# EAGLE design RespiroProject v0.4 (EAGLE 8.2.0)
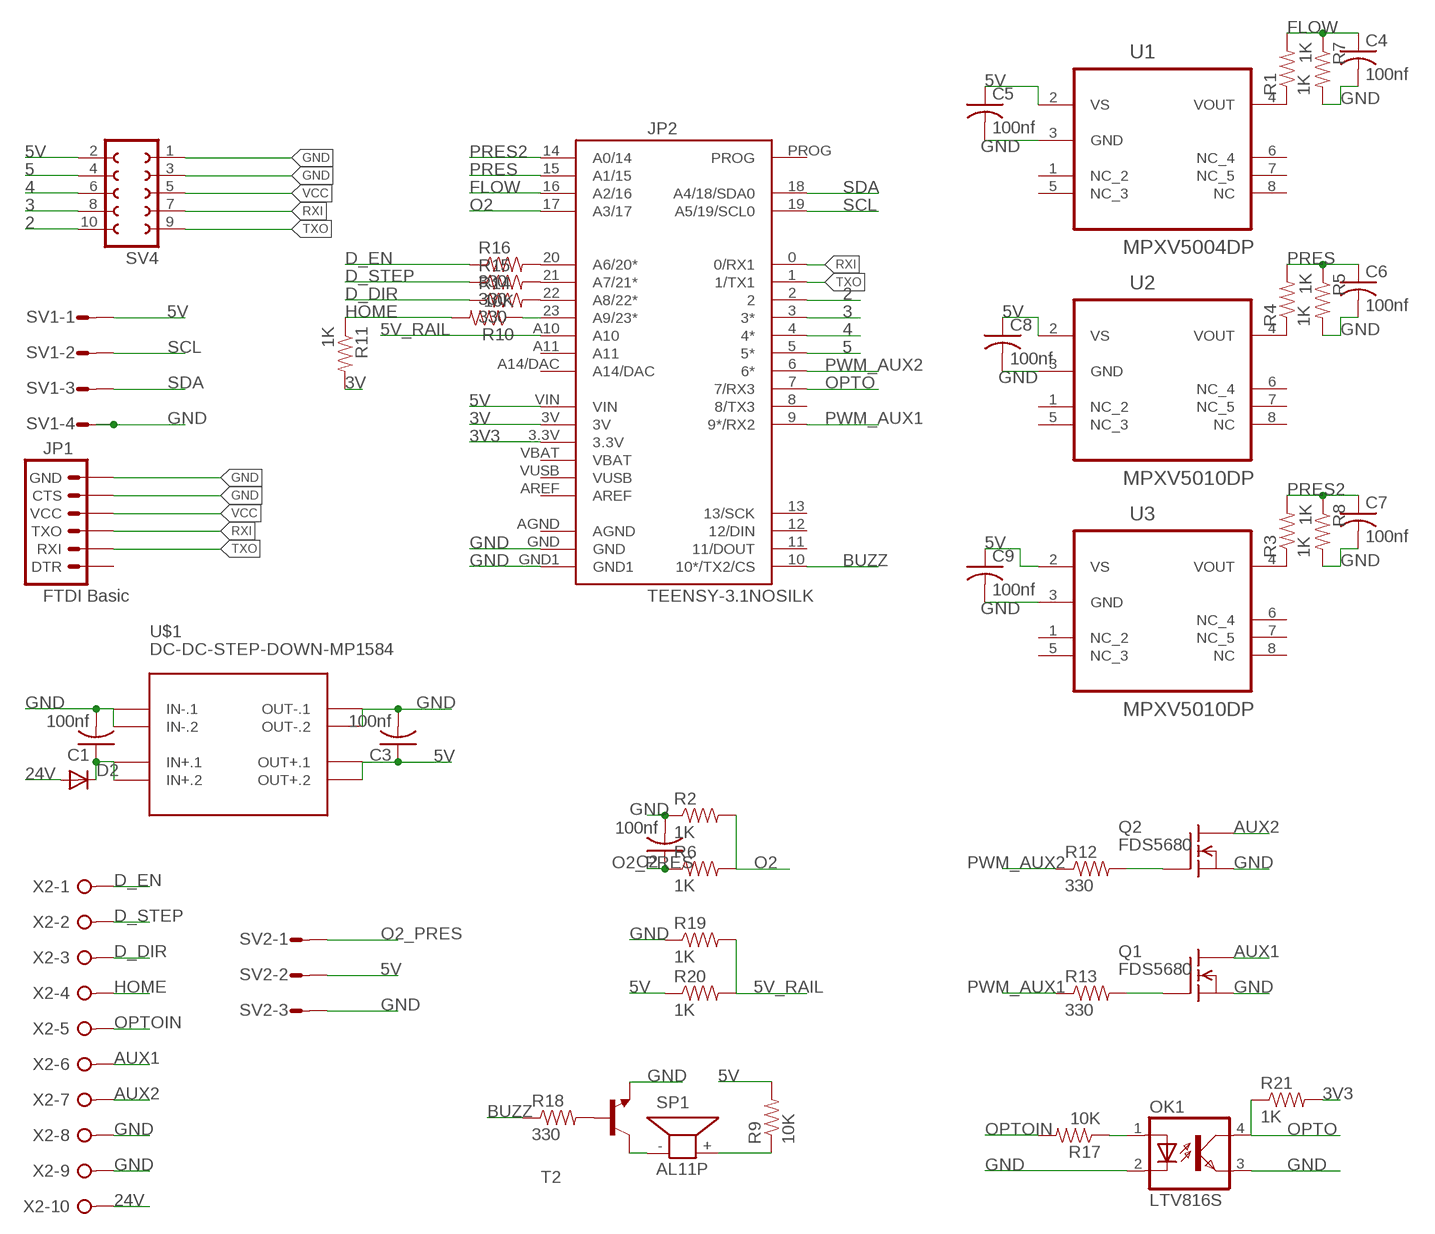
[diagram p0: schematic, sheet 1]

## Parts
C1  100nf  C-USC0805  [C0805]
C2  100nf  C-USC0805  [C0805]
C3  100nf  C-USC0805  [C0805]
C4  100nf  C-USC0805  [C0805]
C5  100nf  C-USC0805  [C0805]
C6  100nf  C-USC0805  [C0805]
C7  100nf  C-USC0805  [C0805]
C8  100nf  C-USC0805  [C0805]
C9  100nf  C-USC0805  [C0805]
D2  DIODE-MINIMELF  [MINIMELF]
JP1  FTDI Basic  ARDUINO_SERIAL_PROGRAMPTH  [1X06]
JP2  TEENSY-3.1NOSILK  [TEENSY-3.1_NOSILK]
OK1  LTV816S  [DIL4-SMD]
Q1  FDS5680  [SO-8]
Q2  FDS5680  [SO-8]
R1  1K  RESISTOR0805-RES  [0805]
R2  1K  RESISTOR0805-RES  [0805]
R3  1K  RESISTOR0805-RES  [0805]
R4  1K  RESISTOR0805-RES  [0805]
R5  1K  RESISTOR0805-RES  [0805]
R6  1K  RESISTOR0805-RES  [0805]
R7  1K  RESISTOR0805-RES  [0805]
R8  1K  RESISTOR0805-RES  [0805]
R9  10K  RESISTOR0805-RES  [0805]
R10  10K  RESISTOR0805-RES  [0805]
R11  1K  RESISTOR0805-RES  [0805]
R12  330  RESISTOR0805-RES  [0805]
R13  330  RESISTOR0805-RES  [0805]
R14  330  RESISTOR0805-RES  [0805]
R15  330  RESISTOR0805-RES  [0805]
R16  330  RESISTOR0805-RES  [0805]
R17  10K  RESISTOR0805-RES  [0805]
R18  330  RESISTOR0805-RES  [0805]
R19  1K  RESISTOR0805-RES  [0805]
R20  1K  RESISTOR0805-RES  [0805]
R21  1K  RESISTOR0805-RES  [0805]
SP1  AL11P  [AL11P]
SV1  S04P  [S04P]
SV2  S03P  [S03P]
SV4  FE05-2  [FE05-2]
T2  BC817-16-NPN-SOT23-BEC  [SOT23-BEC]
U1  MPXV5004DP  [FREESCALE_CASE_1351-01]
U2  MPXV5010DP  MPXV5004DP  [FREESCALE_CASE_1351-01]
U3  MPXV5010DP  MPXV5004DP  [FREESCALE_CASE_1351-01]
U$1  DC-DC-STEP-DOWN-MP1584  [DC-DC-STEP-DOWN-MP1584]
X2  W237-10P  [W237-10P]

## Nets
2: JP2.2 SV4.10
3: JP2.3(3*) SV4.8
3V: JP2.3V R11.2
3V3: JP2.3.3V R21.2
4: JP2.4(4*) SV4.6
5: JP2.5(5*) SV4.4
5V: C3.1 C5.1 C8.1 C9.1 JP2.VIN R9.2 R20.1 SV1.1 SV2.2 SV4.2 U1.2(VS) U2.2(VS) U3.2(VS) U$1.OUT+.1 U$1.OUT+.2
5V_RAIL: JP2.A10 R19.2 R20.2
24V [power]: D2.A X2.10
AUX1 [power]: Q1.5(D) Q1.6(D) Q1.7(D) Q1.8(D) X2.6
AUX2: Q2.5(D) Q2.6(D) Q2.7(D) Q2.8(D) X2.7
BUZZ: JP2.10(10*/TX2/CS) R18.1
D_DIR: R14.1 X2.3
D_EN: R16.1 X2.1
D_STEP: R15.1 X2.2
FLOW: C4.1 JP2.16(A2/16) R1.2 R7.1
GND [power]: C1.2 C2.2 C3.2 C4.2 C5.2 C6.2 C7.2 C8.2 C9.2 JP1.5(CTS) JP1.6(GND) JP2.GND JP2.GND1 OK1.2(C) OK1.3(EMIT) Q1.1(S) Q1.2(S) Q1.3(S) Q2.1(S) Q2.2(S) Q2.3(S) R2.1 R5.2 R7.2 R8.2 R19.1 SV1.4 SV2.3 SV4.1 SV4.3 T2.E U1.3(GND) U2.3(GND) U3.3(GND) U$1.IN-.1 U$1.IN-.2 U$1.OUT-.1 U$1.OUT-.2 X2.8 X2.9
HOME: R10.2 R11.1 X2.4
N$1: C1.1 D2.C U$1.IN+.1 U$1.IN+.2
N$2: R1.1 U1.4(VOUT)
N$3: R3.1 U3.4(VOUT)
N$4: R4.1 U2.4(VOUT)
N$5: SP1.- T2.C
N$6: R9.1 SP1.+
N$8: JP2.23(A9/23*) R10.1
N$9: JP2.22(A8/22*) R14.2
N$10: Q2.4(G) R12.2
N$11: Q1.4(G) R13.2
N$12: JP2.21(A7/21*) R15.2
N$13: JP2.20(A6/20*) R16.2
N$14: OK1.1(A) R17.1
N$15: R18.2 T2.B
O2: JP2.17(A3/17) R2.2 R6.2
O2_PRES: C2.1 R6.1 SV2.1
OPTO: JP2.7(7/RX3) OK1.4(COL) R21.1
OPTOIN: R17.2 X2.5
PRES: C6.1 JP2.15(A1/15) R4.2 R5.1
PRES2: C7.1 JP2.14(A0/14) R3.2 R8.1
PWM_AUX1: JP2.9(9*/RX2) R13.1
PWM_AUX2: JP2.6(6*) R12.1
RXI: JP1.3(TXO) JP2.0(0/RX1) SV4.7
SCL: JP2.19(A5/19/SCL0) SV1.2
SDA: JP2.18(A4/18/SDA0) SV1.3
TXO: JP1.2(RXI) JP2.1(1/TX1) SV4.9
VCC: JP1.4(VCC) SV4.5
Unconnected: JP1.1(DTR) JP2.8(8/TX3) JP2.11(11/DOUT) JP2.12(12/DIN) JP2.13(13/SCK) JP2.A11 JP2.A14/DAC JP2.AGND JP2.AREF JP2.PROG JP2.VBAT JP2.VUSB U1.1(NC_2) U1.5(NC_3) U1.6(NC_4) U1.7(NC_5) U1.8(NC) U2.1(NC_2) U2.5(NC_3) U2.6(NC_4) U2.7(NC_5) U2.8(NC) U3.1(NC_2) U3.5(NC_3) U3.6(NC_4) U3.7(NC_5) U3.8(NC)

## Library data of the parts
C1-C9 = rcl:C-US: CAPACITOR, American symbol
D2 = diode:DIODE-: DIODE
JP1 = SparkFun:ARDUINO_SERIAL_PROGRAM
JP2 = Testing:TEENSY-3.1
OK1 = optocoupler:LTV816: OPTO COUPLER Source: LITEON, LTV816.pdf
Q1 Q2 = transistor-fet:FDS5680: 60V N-Channel PowerTrench TM MOSFET FAIRCHILD FDS5680.pdf
R1-R21 = SparkFun:RESISTOR: Resistor Basic schematic elements and footprints for 0603, 1206, and PTH resistors.
SP1 = buzzer:AL11P: SPEAKER Source: Buerklin; OC_FARNELL: unknown; OC_NEWARK: unknown
SV1 = con-amp-mt:S04P: AMP MT CONNECTOR; OC_FARNELL: unknown; OC_NEWARK: unknown
SV2 = con-amp-mt:S03P: AMP MT CONNECTOR; OC_FARNELL: unknown; OC_NEWARK: unknown
SV4 = con-lsta:FE05-2: FEMALE HEADER; OC_FARNELL: unknown; OC_NEWARK: unknown
T2 = transistor-neu-to92:*-NPN-: NPN Transistror
U1-U3 = Freescale-MPxx_MRFxx:MP: Integrated Silicon Pressure Sensor On-Chip Signal Conditioned,Temperature Compensated and Calibrated,CASE 1351-01; MPN: MPXV5004DP; OC_FARNELL: 1457165; OC_NEWARK: 75C3903; PACKAGE: CASE 1351-01; SUPPLIER: FREESCALE SEMICONDUCTOR
U$1 = diy-modules:DC-DC-STEP-DOWN-MP1584: DC/DC Step-Down Regulator based on MP1584 chip MP1584 datasheet available here: http://www.haoyuelectronics.com/Attachment/MP1584/MP1584.pdf Click here to find device on ebay.com <http://www.ebay.com/sch/mp1584+module>
X2 = con-wago-508:W237-10P: WAGO SREW CLAMP; OC_FARNELL: unknown; OC_NEWARK: unknown

## Net classes
1 power: width 0.254 mm, drill 0.711 mm, clearance 0.355 mm to class 0, clearance 0.355 mm
2 gnd: width 0.254 mm, drill 0.711 mm, clearance 0.355 mm to class 0, clearance 0.355 mm to class 1, clearance 0.355 mm

## Board
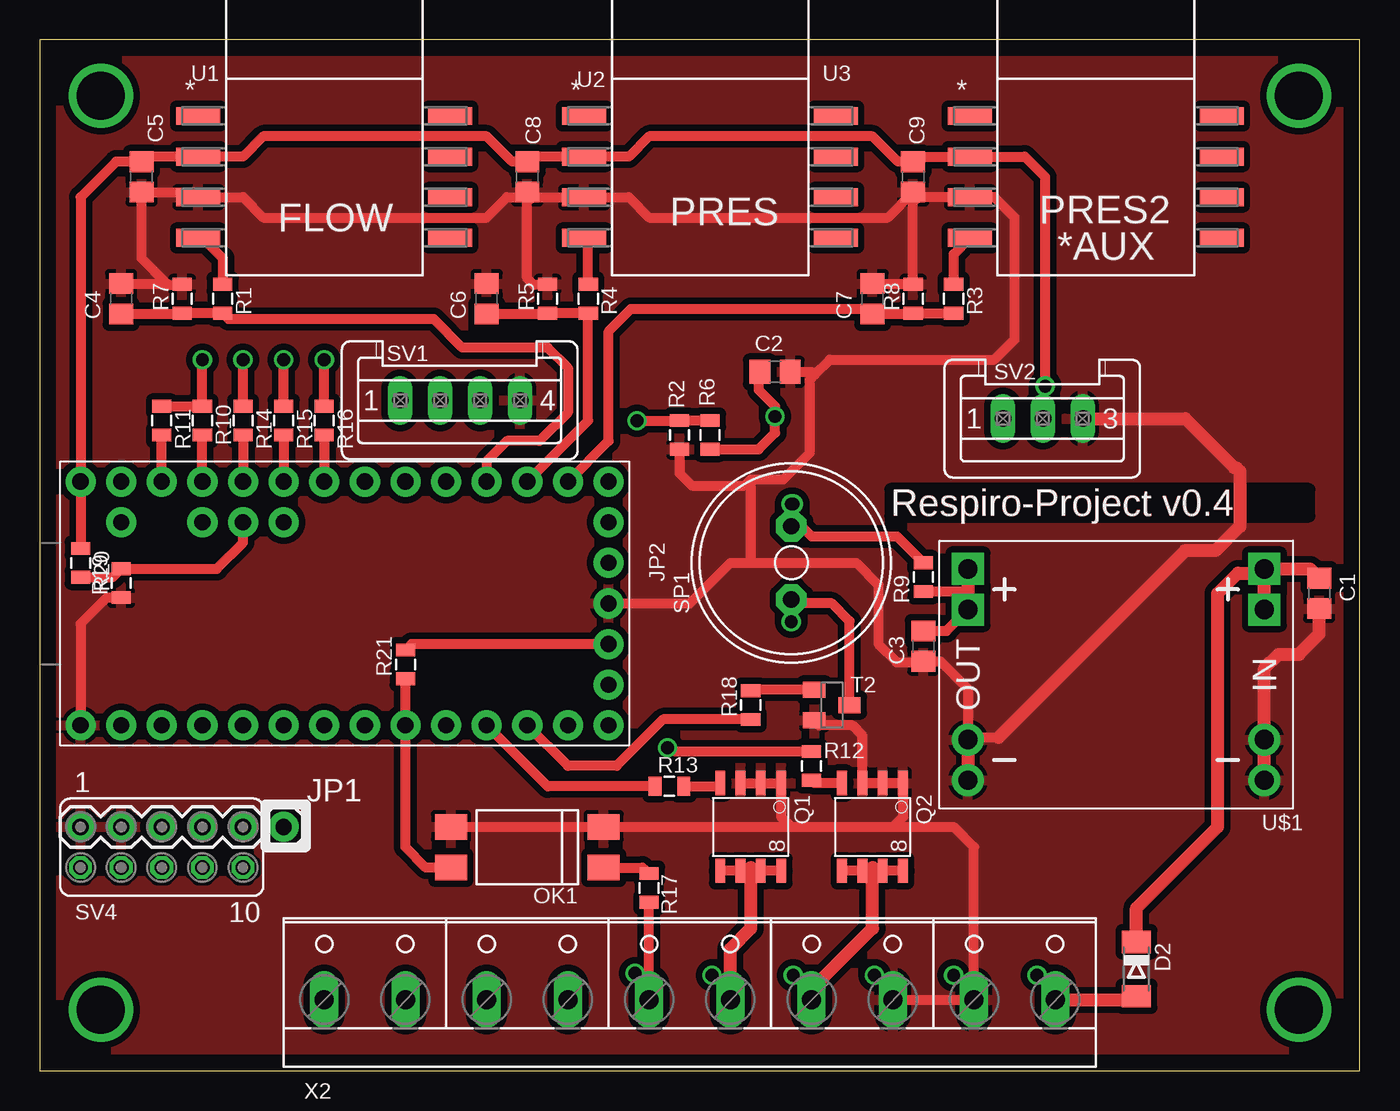
[diagram p1: board, top side]
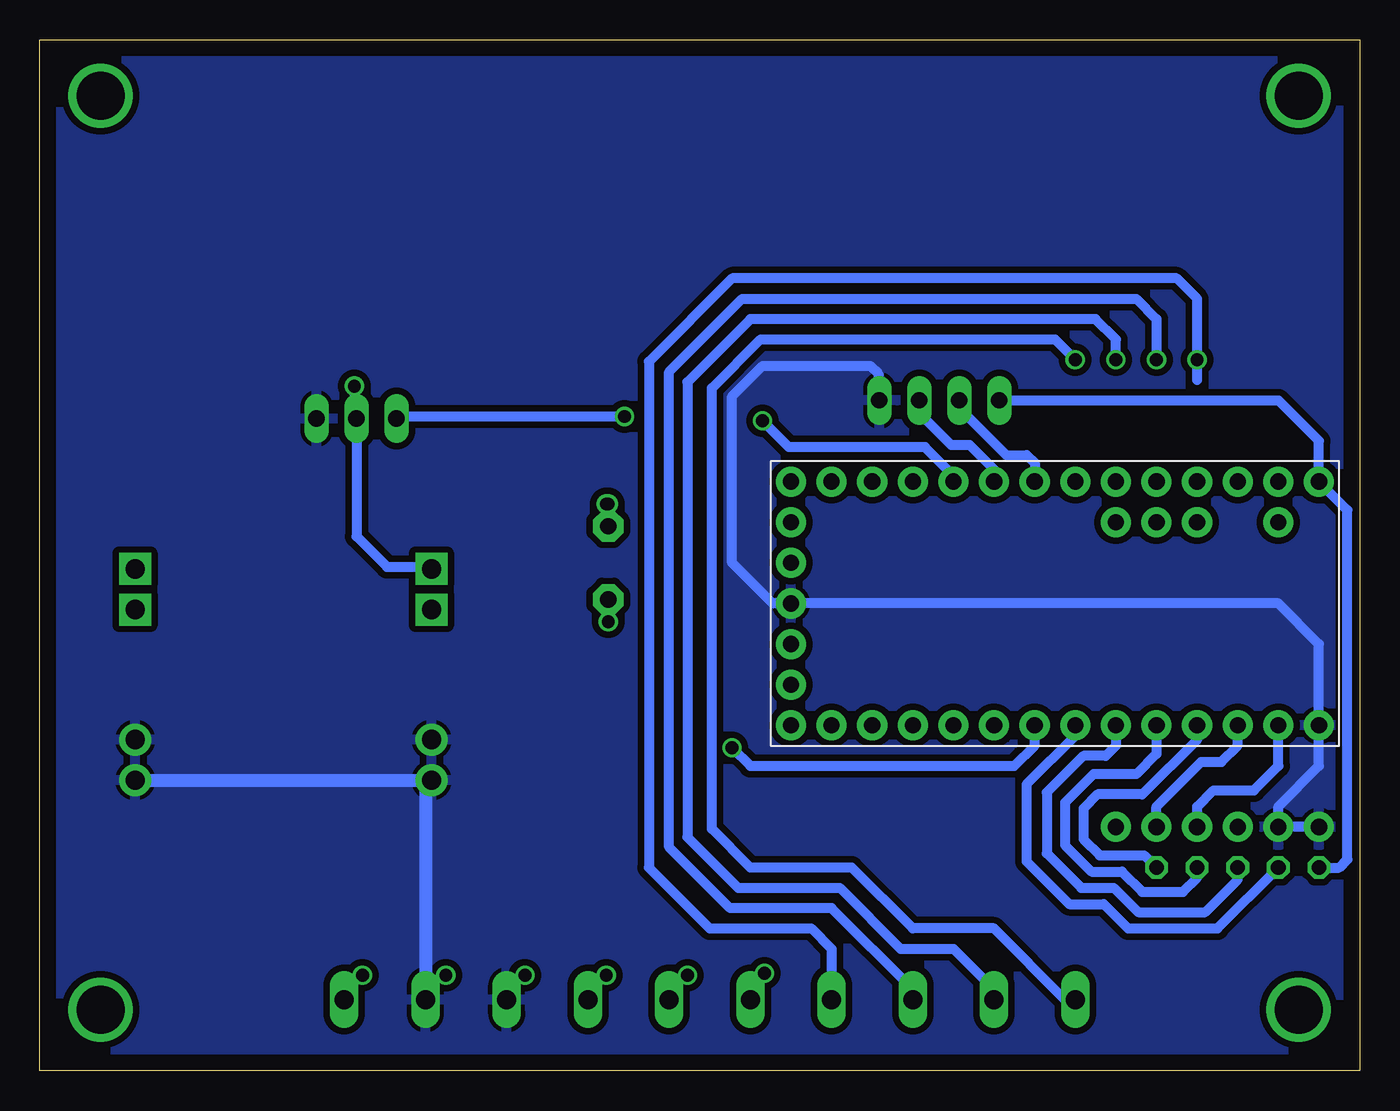
[diagram p2: board, bottom side, seen from below]

Size 82.53 x 64.44 mm. Coordinates in mm from the lower left corner, seen from the top.
Outline: 0,0 82.53,0 82.53,64.44 0,64.44 0,0
Copper layers (1*16): Top 0.035mm / dielectric 1.5mm / Bottom 0.035mm
Design rules "default": minimum track width 6mil, minimum drill 0.35mm, track to track 6mil, track to pad 6mil, pad to pad 6mil, via to via 6mil, smd to smd 6mil, copper to edge 40mil, drill to drill 6mil, minimum pad ring 10mil, minimum via ring 8mil, stop-mask expansion 4mil, vias tented up to drill 0mil, thermal gap 10mil

### Footprints (pad centres in the part's own frame; a part is rotated, then mirrored left to right if it is on the bottom)
C0805 = smd 1.3 x 1.5: 1 -0.95,0; 2 0.95,0
MINIMELF = smd 1.4 x 1.8: A 1.7,0; C -1.7,0
1X06 = drill 1.016 pad 1.88: 1 0,0; 2 2.54,0; 3 5.08,0; 4 7.62,0; 5 10.16,0; 6 12.7,0
TEENSY-3.1_NOSILK = drill 1.016 pad 1.88: 0 16.51,3.81; 1 16.51,6.35; 2 16.51,8.89; 3 16.51,11.43; 3.3V 11.43,34.29; 3V 1.27,6.35; 4 16.51,13.97; 5 16.51,16.51; 6 16.51,19.05; 7 16.51,21.59; 8 16.51,24.13; 9 16.51,26.67; 10 16.51,29.21; 11 16.51,31.75; 12 16.51,34.29; 13 1.27,34.29; 14 1.27,31.75; 15 1.27,29.21; 16 1.27,26.67; 17 1.27,24.13; 18 1.27,21.59; 19 1.27,19.05; 20 1.27,16.51; 21 1.27,13.97; 22 1.27,11.43; 23 1.27,8.89; A10 3.81,11.43; A11 3.81,13.97; A14/DAC 3.81,34.29; AGND 1.27,3.81; AREF 3.81,8.89; GND 8.89,34.29; GND1 16.51,1.27; PROG 6.35,34.29; VBAT 13.97,34.29; VIN 1.27,1.27; VUSB 3.81,3.81
DIL4-SMD = smd 1.6 x 2: 1 -1.27,-4.77; 2 1.27,-4.77; 3 1.27,4.77; 4 -1.27,4.77
SO-8 = smd 1.524 x 0.61: 1 -2.743,1.905; 2 -2.743,0.635; 3 -2.743,-0.635; 4 -2.743,-1.905; 5 2.743,-1.905; 6 2.743,-0.635; 7 2.743,0.635; 8 2.743,1.905
0805 = smd 0.8 x 1.2: 1 -0.9,0; 2 0.9,0
AL11P = drill 1.016 pad 1.905 octagon: + 2.286,0; - -2.286,0
S04P = drill 1.016 long: 1 3.75,0; 2 1.25,0; 3 -1.25,0; 4 -3.75,0
S03P = drill 1.016 long: 1 2.5,0; 2 0,0; 3 -2.5,0
FE05-2 = drill 0.914: 1 -5.08,1.27 | drill 0.914 octagon: 2 -5.08,-1.27; 3 -2.54,1.27; 4 -2.54,-1.27; 5 0,1.27; 6 0,-1.27; 7 2.54,1.27; 8 2.54,-1.27; 9 5.08,1.27; 10 5.08,-1.27
SOT23-BEC = smd 1 x 1.4: B -0.95,-1.1; C 0,1.1; E 0.95,-1.1
FREESCALE_CASE_1351-01 = smd 2.743 x 1.118: 1 -7.874,3.81; 2 -7.874,1.27; 3 -7.874,-1.27; 4 -7.874,-3.81; 5 7.874,-3.81; 6 7.874,-1.27; 7 7.874,1.27; 8 7.874,3.81
DC-DC-STEP-DOWN-MP1584 = drill 1.2 pad 2 square: IN+.1 -9.271,-4.064; IN+.2 -9.271,-6.604; OUT+.1 9.271,-4.064; OUT+.2 9.271,-6.604 | drill 1.2 pad 2: IN-.1 -9.271,6.604; IN-.2 -9.271,4.064; OUT-.1 9.271,6.604; OUT-.2 9.271,4.064
W237-10P = drill 1.194 long: 1 -22.86,-0.635; 2 -17.78,-0.635; 3 -12.7,-0.635; 4 -7.62,-0.635; 5 -2.54,-0.635; 6 2.54,-0.635; 7 7.62,-0.635; 8 12.7,-0.635; 9 17.78,-0.635; 10 22.86,-0.635

### Placement (x,y rotation side)
C1  80.01,29.84 270 top
C2  45.97,43.69 0 top
C3  55.24,26.54 270 top
C4  5.08,48.26 90 top
C5  6.35,55.88 270 top
C6  27.94,48.26 90 top
C7  52.07,48.26 90 top
C8  30.48,55.88 270 top
C9  54.61,55.88 270 top
D2  68.58,6.35 270 top
JP1  15.24,15.24 180 top
JP2  1.27,38.1 270 top
OK1  30.48,13.97 90 top
Q1  44.45,15.24 270 top
Q2  52.07,15.24 270 top
R1  11.43,48.26 270 top
R2  40.01,39.75 90 top
R3  57.15,48.26 270 top
R4  34.29,48.26 270 top
R5  31.75,48.26 90 top
R6  41.91,39.75 90 top
R7  8.89,48.26 90 top
R8  54.61,48.26 90 top
R9  55.24,30.86 270 top
R10  10.16,40.64 90 top
R11  7.62,40.64 270 top
R12  48.26,19.05 270 top
R13  39.37,17.78 0 top
R14  12.7,40.64 270 top
R15  15.24,40.64 270 top
R16  17.78,40.64 270 top
R17  38.1,11.43 270 top
R18  44.45,22.86 90 top
R19  5.08,30.48 90 top
R20  2.54,31.75 270 top
R21  22.86,25.4 90 top
SP1  46.99,31.75 90 top
SV1  26.29,41.91 180 top
SV2  62.74,40.77 180 top
SV4  7.62,13.97 0 top
T2  49.53,22.86 270 top
U1  17.78,55.88 0 top
U2  41.91,55.88 0 top
U3  66.04,55.88 0 top
U$1  67.31,24.77 180 top
X2  40.64,5.08 0 top

### Tracks (layer width: path | path; a pad name or v marks a point on that pad's centre or on a via)
2
  Bottom 0.61: JP2.2 10.16,20.7 13.59,17.27 16.38,17.27 17.27,16.38 17.27,14.48 16.26,13.46 13.46,13.46 SV4.10
3
  Bottom 0.61: JP2.3 12.7,19.81 13.97,18.54 16.64,18.54 18.41,16.76 18.41,14.1 16.76,12.45 14.86,12.45 13.59,11.18 11.05,11.18 10.16,12.06 SV4.8
3V
  Top 0.61: JP2.3V R11.2
3V3
  Top 0.61: JP2.3.3V 23.23,26.67 R21.2
4
  Bottom 0.61: JP2.4 15.24,20.32 15.88,19.68 17.27,19.68 19.56,17.4 19.56,13.59 17.4,11.43 15.37,11.43 13.84,9.91 9.65,9.91 7.62,11.94 SV4.6
5
  Bottom 0.61: JP2.5 17.78,20.95 20.83,17.91 20.83,13.08 18.16,10.41 16,10.41 14.48,8.89 8.89,8.89 SV4.4
5V  (via drill 0.8)
  Top 0.61: R20.1 JP2.VIN 2.54,54.61 4.76,56.83 C5.1 6.67,57.15 U1.2 12.7,57.15 13.97,58.42 27.94,58.42 29.53,56.83 C8.1 30.8,57.15 U2.2 36.83,57.15 38.1,58.42 52.07,58.42 53.66,56.83 C9.1 54.93,57.15 U3.2 61.59,57.15 62.87,55.88 v62.87,42.8 | C3.1 56.7,27.49 U$1.OUT+.1 | R9.2 57.9,29.96 58.04,30.1
  Top 0.813: U$1.OUT+.1 58.04,30.1 U$1.OUT+.2 57.47,30.8
  Bottom 0.61: SV1.1 5.08,41.91 2.54,39.37 JP2.VIN 0.76,35.05 0.76,13.21 1.27,12.7 SV4.2 | U$1.OUT+.2 58.17,31.5 60.83,31.5 62.74,33.4 SV2.2 62.87,40.89 v62.87,42.8
5V_RAIL
  Top 0.61: R20.2 4.55,30.85 R19.2 11.06,31.38 12.7,33.02 JP2.A10
24V
  Top 0.813: X2.10 68.38,4.45 D2.A
AUX1
  Top 0.61: Q1.8 Q1.7 | Q1.7 Q1.6 Q1.5 | Q1.7 44.65,12.5 44.45,12.7
  Top 0.813: X2.6 43.18,7.62 44.45,8.89 44.45,12.7
AUX2
  Top 0.61: Q2.8 Q2.7 52.27,12.5 52.07,12.7 51.64,12.7 Q2.6 Q2.5
  Top 0.813: X2.7 48.26,5.08 52.07,8.89 52.07,12.7
BUZZ
  Top 0.61: R18.1 38.98,21.96 36.07,19.05 33.02,19.05 JP2.10
D_DIR  (via drill 0.8)
  Top 0.61: R14.1 v12.7,44.45
  Bottom 0.61: X2.3 27.94,5.08 33.02,10.16 39.37,10.16 43.18,13.97 43.18,43.69 38.61,48.26 13.97,48.26 12.7,46.99 v12.7,44.45
D_EN  (via drill 0.8)
  Top 0.61: R16.1 v17.78,44.45
  Bottom 0.61: X2.1 18.41,4.45 22.86,8.89 27.94,8.89 31.75,12.7 38.1,12.7 40.51,15.11 40.51,42.67 37.47,45.72 19.05,45.72 v17.78,44.45
D_STEP  (via drill 0.8)
  Top 0.61: R15.1 v15.24,44.45
  Bottom 0.61: v15.24,44.45 15.24,45.72 16.51,46.99 38.1,46.99 42.04,43.05 42.04,14.61 38.86,11.43 32.51,11.43 28.7,7.62 25.4,7.62 22.86,5.08 X2.2
FLOW
  Top 0.61: C4.1 8.84,47.31 R7.1 R1.2 11.8,46.99 24.64,46.99 26.42,45.21 31.75,45.21 33.02,43.94 33.02,41.15 31.24,39.37 29.21,39.37 27.94,38.1 JP2.16
GND
  Top 0.61: 30.8,54.61 U2.3 36.83,54.61 38.1,53.34 53.02,53.34 C9.2 54.93,54.61 | 30.8,54.61 C8.2 30.16,54.61 29.21,54.61 27.94,53.34 13.97,53.34 12.7,54.61 U1.3 9.59,54.93 C5.2 6.35,50.8 7.94,49.21 | 54.93,54.61 U3.3 59.69,54.61 60.96,53.34 60.96,45.72 59.69,44.45 49.4,44.45 48.45,43.5 | 54.93,54.61 54.61,54.29 R8.2 54.56,49.21 C7.2 | R5.2 30.9,49.11 30.48,49.53 30.48,54.29 30.8,54.61 | R7.2 8.04,49.11 7.94,49.21 | C4.2 7.94,49.21 | Q1.3 Q1.2 Q1.1 46.35,15.88 46.99,15.24 | 53.34,15.24 53.98,15.88 Q2.1 Q2.3 51.44,20.95 50.8,21.59 48.75,21.59 T2.E | 46.99,15.24 53.34,15.24 | 53.34,15.24 57.15,15.24 58.42,13.97 X2.9 X2.8 | OK1.3 OK1.2 46.99,15.24 | JP2.GND 40.64,29.21 43.18,31.75 44.45,31.75 | R19.1 4.18,29.58 2.54,27.94 JP2.GND1 | 44.45,36.96 44.45,31.75 | 44.45,31.75 51.05,31.75 52.45,30.35 52.45,26.67 53.59,25.53 55.18,25.53 C3.2 56.32,25.59 58.04,23.88 U$1.OUT-.2 58.17,20.83 59.94,20.83 65.24,26.12 | R2.1 40.01,37.34 40.77,36.58 44.07,36.58 44.45,36.96 | 48.45,43.5 48.13,43.18 48.13,38.61 46.48,36.96 44.45,36.96 | C2.2 48.26,43.69 48.45,43.5
  Top 0.813: U$1.IN-.1 U$1.IN-.2 76.58,25.15 77.47,26.04 78.74,26.04 80.01,27.3 C1.2 | U$1.OUT-.2 U$1.OUT-.1 | SV2.3 71.63,40.77 74.73,37.67 74.85,37.67 75.06,37.47 75.06,34.04 73.53,32.51 71.63,32.51 59.94,20.83
  Bottom 0.61: SV4.1 SV4.3 5.08,16.51 2.54,19.05 JP2.GND1 2.54,26.67 5.08,29.21 JP2.GND | 57.78,18.41 U$1.OUT-.1 | JP2.GND 36.45,29.21 | JP2.GND 36.7,29.21 39.24,31.75 39.24,42.16 37.34,44.07 30.61,44.07 30.1,43.56 30.1,41.97 SV1.4
  Bottom 0.813: 58.42,17.78 X2.9 | U$1.OUT-.1 58.42,17.78 | U$1.IN-.1 58.8,18.16 58.42,17.78
  pour Top (isolate 0.406): 0.25,64.01 82.3,64.01 82.3,0.13 0.25,0.13
  pour Bottom (isolate 0.406): 82.3,64.01 0.25,64.01 0.25,0.13 82.3,0.13
HOME  (via drill 0.8)
  Top 0.61: R11.1 R10.2 v10.16,44.45
  Bottom 0.61: 10.16,43.18 v10.16,44.45 10.16,48.26 11.43,49.53 39.24,49.53 44.45,44.32 44.45,12.7 40.64,8.89 34.29,8.89 33.02,7.62 X2.4
N$1
  Top 0.813: D2.C 68.58,10.16 73.66,15.24 73.66,29.84 74.93,31.11 76.33,31.11 U$1.IN+.2 | U$1.IN+.2 79.44,31.37 C1.1 | U$1.IN+.1 U$1.IN+.2
N$2
  Top 0.61: U1.4 10.16,52.07 11.43,50.8 R1.1
N$3
  Top 0.61: R3.1 57.15,51.05 U3.4
N$4
  Top 0.61: R4.1 34.29,51.82 U2.4
N$5
  Top 0.61: T2.C 50.63,28.11 49.53,29.21 47.24,29.21 SP1.-
N$6
  Top 0.61: SP1.+ 47.62,34.04 48.26,33.4 53.6,33.4 R9.1
N$7  (via drill 0.8)
  other vias: 46.99,35.43
N$8
  Top 0.61: JP2.23 R10.1
N$9
  Top 0.61: R14.2 JP2.22
N$10
  Top 0.61: Q2.4 48.43,17.98 R12.2
N$11
  Top 0.61: R13.2 42.34,17.78 Q1.4
N$12
  Top 0.61: R15.2 JP2.21
N$13
  Top 0.61: R16.2 JP2.20
N$14
  Top 0.61: OK1.1 37.68,12.7 R17.1
N$15
  Top 0.61: T2.B 44.5,23.81 R18.2
N$16  (via drill 3 pad 4)
  other vias: 3.81,60.96
N$17  (via drill 3 pad 4)
  other vias: 3.81,3.81
N$18  (via drill 3 pad 4)
  other vias: 78.74,3.81
N$19  (via drill 3 pad 4)
  other vias: 78.74,60.96
N$20  (via drill 0.8)
  other vias: 46.99,28.07
N$21  (via drill 0.8)
  other vias: 47.12,35.43
N$22  (via drill 0.8)
  other vias: 37.21,6.1
N$23  (via drill 0.8)
  other vias: 42.04,5.97
N$24  (via drill 0.8)
  other vias: 47.12,5.97
N$25  (via drill 0.8)
  other vias: 52.2,5.97
N$26  (via drill 0.8)
  other vias: 57.15,5.97
N$27  (via drill 0.8)
  other vias: 62.36,5.97
O2  (via drill 0.8)
  Top 0.61: v37.34,40.64 39.99,40.64 R2.2 R6.2
  Bottom 0.61: JP2.17 25.4,37.21 27.18,38.99 35.69,38.99 v37.34,40.64
O2_PRES  (via drill 0.8)
  Top 0.61: R6.1 44.95,38.85 45.97,39.88 v45.97,40.89 45.97,41.53 44.96,42.55 44.96,43.62 C2.1
  Bottom 0.61: v45.97,40.89 60.11,40.89 SV2.1
OPTO
  Top 0.61: OK1.4 24.13,12.7 22.86,13.97 JP2.7 R21.1
OPTOIN
  Top 0.61: X2.5 R17.2
PRES
  Top 0.61: C6.1 31.7,47.31 R5.1 R4.2 34.29,40.64 JP2.15
PRES2
  Top 0.61: R3.2 R8.1 54.56,47.31 C7.1 51.76,47.62 36.96,47.62 35.56,46.23 35.56,39.37 JP2.14
PWM_AUX1
  Top 0.61: R13.1 31.75,17.78 JP2.9
PWM_AUX2  (via drill 0.8)
  Top 0.61: R12.1 39.74,19.95 v39.24,20.19
  Bottom 0.61: v39.24,20.19 38.1,19.05 21.59,19.05 20.32,20.32 JP2.6
RXI
  Bottom 0.61: SV4.7 10.16,16.51 9.14,17.53 6.6,17.53 5.08,19.05 JP2.0
SCL
  Bottom 0.61: SV1.2 25.04,41.42 22.1,38.48 20.83,38.48 20.32,37.97 JP2.19
SDA
  Bottom 0.61: JP2.18 22.86,37.59 24.38,39.12 25.53,39.12 27.43,41.02 27.43,41.8 SV1.3
TXO
  Bottom 0.61: SV4.9 12.7,16.51 9.91,19.3 8.64,19.3 7.62,20.32 JP2.1

### Text on the board
Top: Respiro-Project v0.4
tNames: PRES | PRES2 | FLOW | *AUX | Respiro-Project v0.4